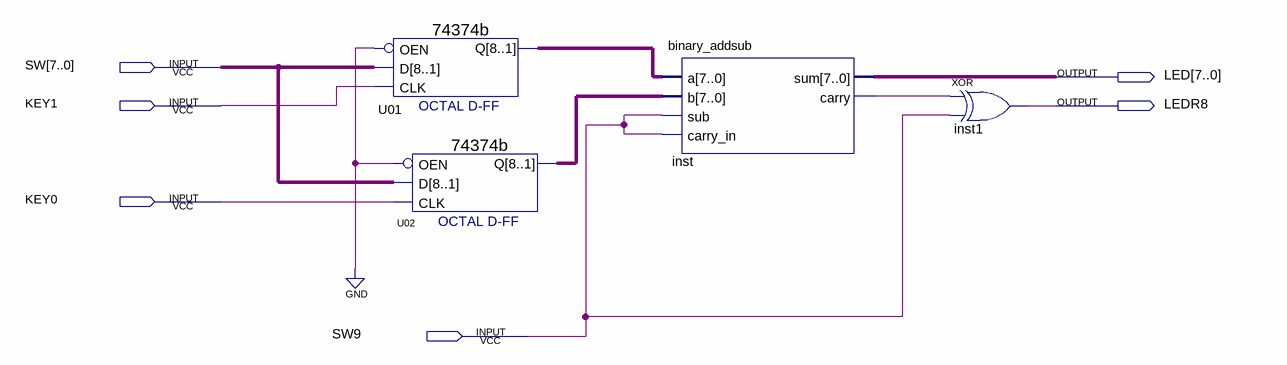
[diagram p0: schematic sheet]
// Quartus schematic binary_addsub_with_latch.bdf as structural Verilog: 4 symbols, 6 pins
module binary_addsub_with_latch (
  input  [7:0] SW,
  input  KEY1,
  input  KEY0,
  input  SW9,
  output [7:0] LED,
  output LEDR8
);

  wire inst_carry;
  wire [7:0] U01_q, U02_q;

  \74374b  U01 (.D(SW), .OEN(1'b0), .CLK(KEY1), .Q(U01_q));
  \74374b  U02 (.D(SW), .OEN(1'b0), .CLK(KEY0), .Q(U02_q));
  binary_addsub inst (.a(U01_q), .b(U02_q), .sub(SW9), .carry_in(SW9), .sum(LED), .carry(inst_carry));
  xor inst1 (LEDR8, inst_carry, SW9);
endmodule
